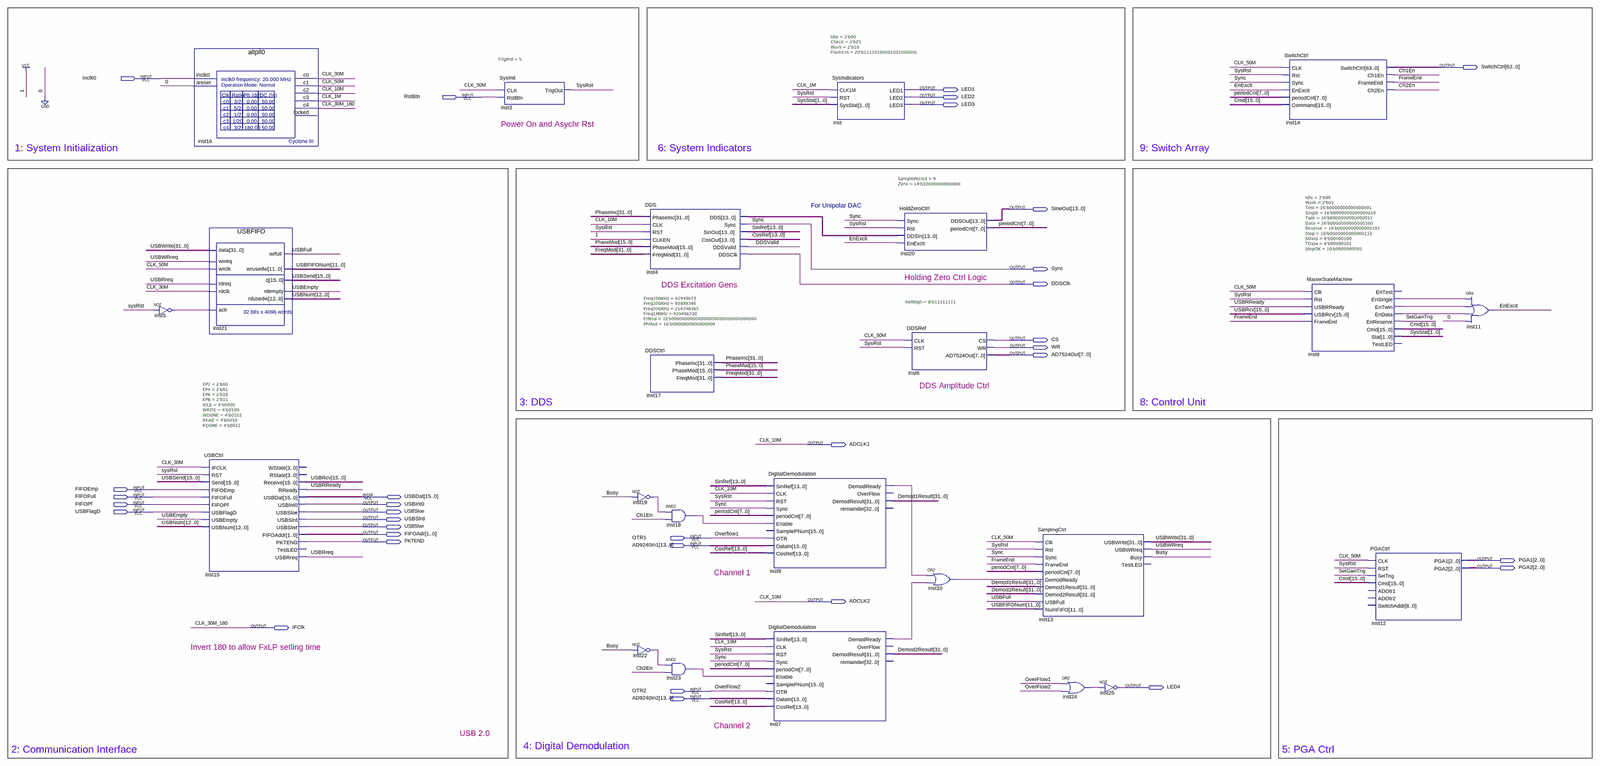
[diagram p0: schematic sheet, whole]
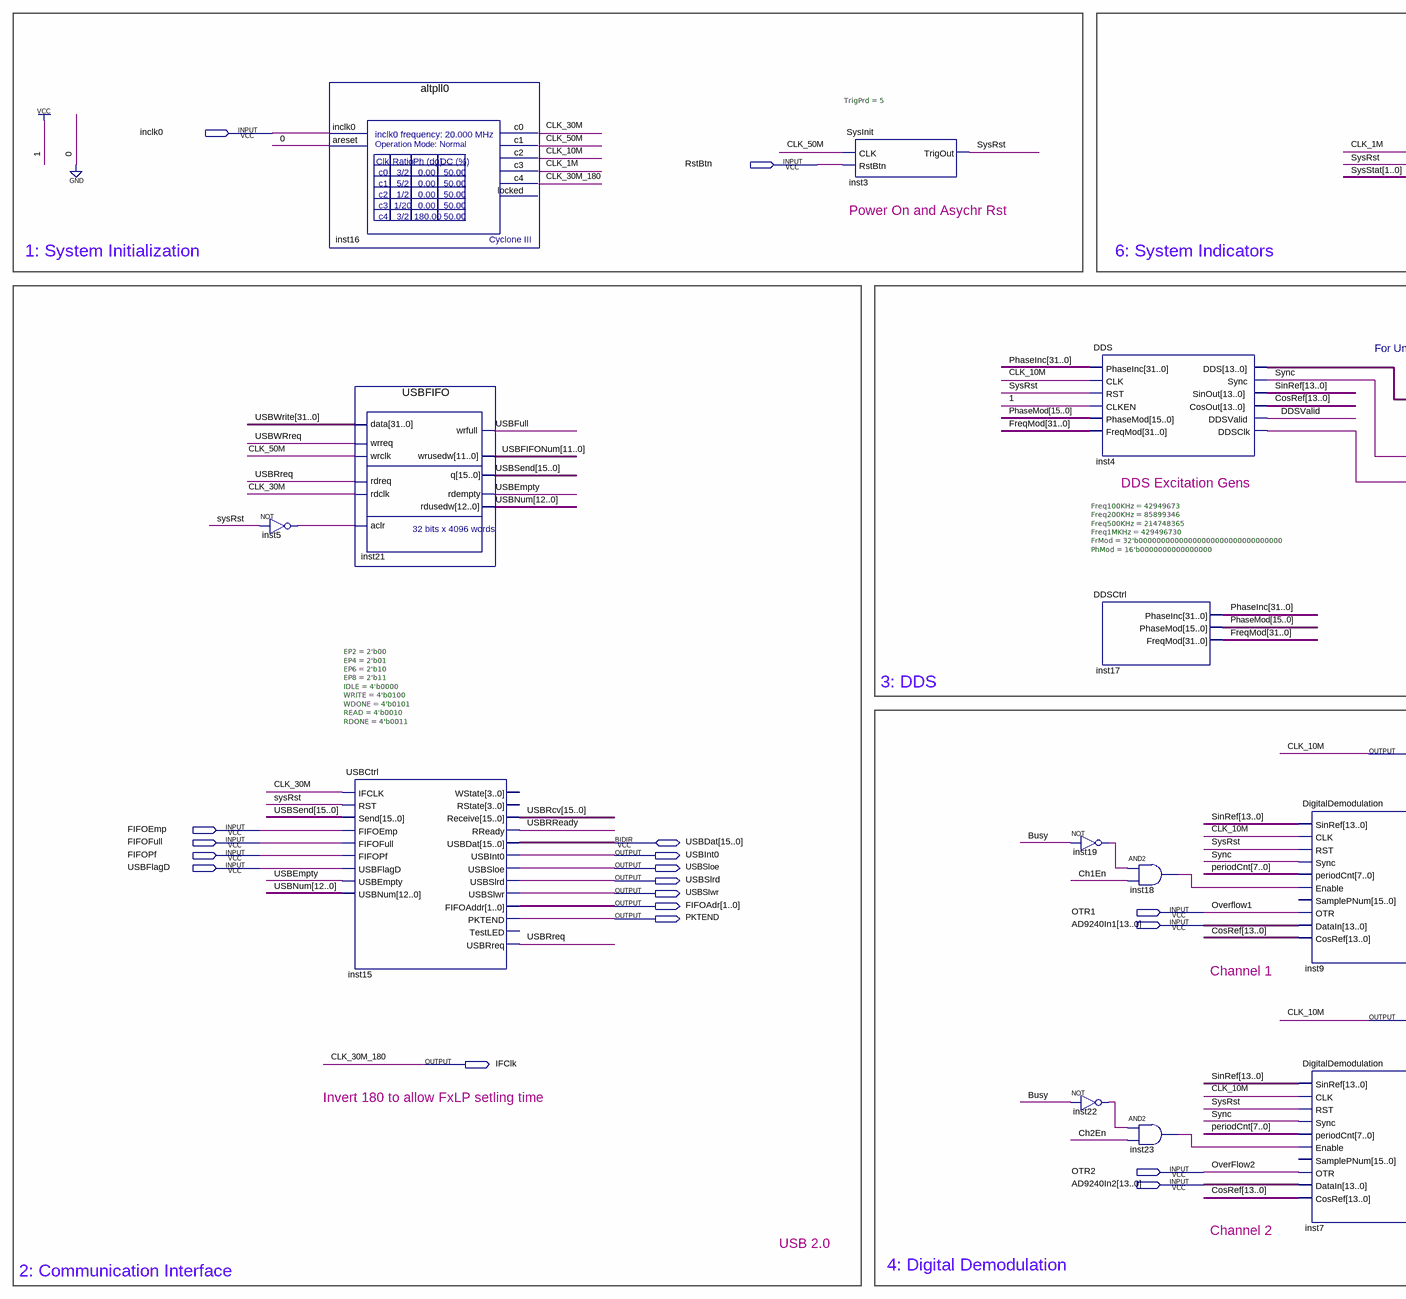
[diagram p1: schematic sheet, left part]
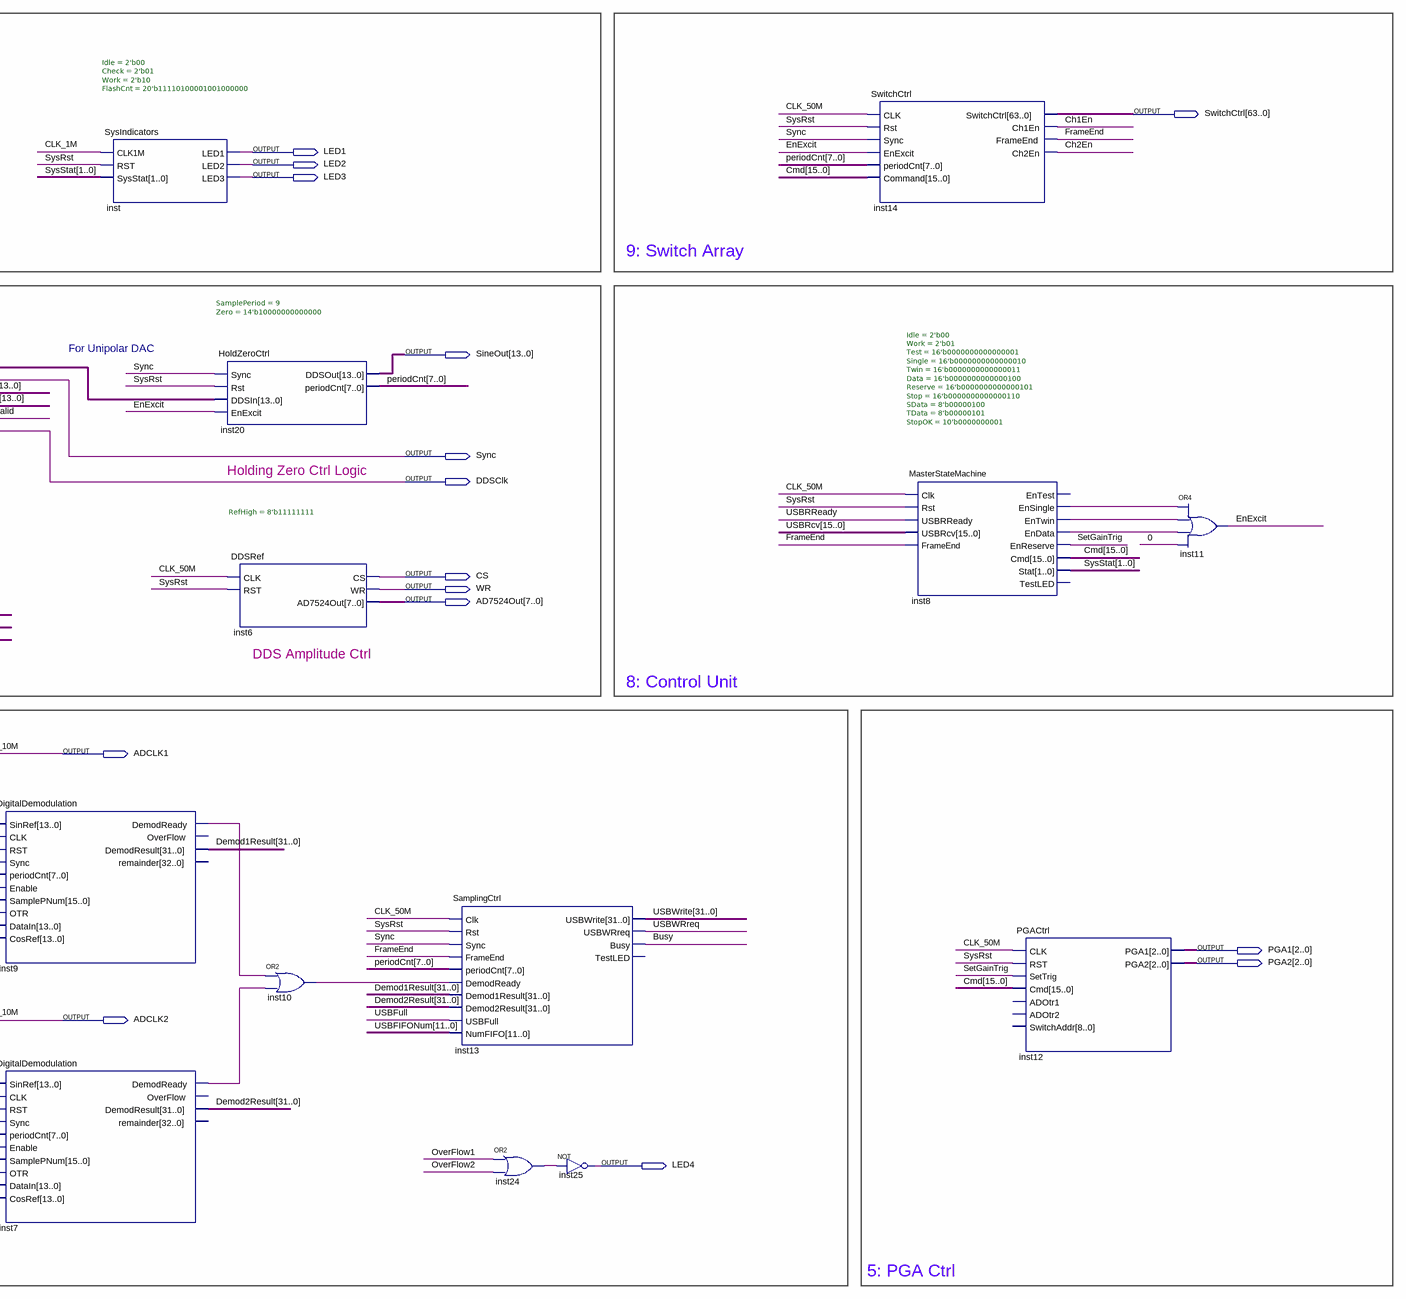
[diagram p2: schematic sheet, right part]
// Quartus schematic ECTNew.bdf as structural Verilog: 24 symbols, 33 pins
module ECTNew (
  input  inclk0,
  input  RstBtn,
  input  FIFOEmp,
  input  FIFOFull,
  input  FIFOPf,
  input  USBFlagD,
  input  OTR1,
  input  [13:0] AD9240In1,
  input  OTR2,
  input  [13:0] AD9240In2,
  inout  [15:0] USBDat,
  output [63:0] SwitchCtrl,
  output LED1,
  output LED2,
  output LED3,
  output [13:0] SineOut,
  output Sync,
  output DDSClk,
  output CS,
  output WR,
  output [7:0] AD7524Out,
  output ADCLK1,
  output USBInt0,
  output USBSloe,
  output USBSlrd,
  output USBSlwr,
  output [1:0] FIFOAdr,
  output PKTEND,
  output [2:0] PGA1,
  output [2:0] PGA2,
  output ADCLK2,
  output IFClk,
  output LED4
);

  wire Busy, Ch1En, Ch2En, CLK_1M, CLK_30M, CLK_50M, DDSValid, EnExcit, FrameEnd, inst5_out,
       inst7_demodready, inst8_endata, inst8_ensingle, inst8_entwin, inst9_demodready, inst10_out,
       inst18_out, inst19_out, inst22_out, inst23_out, inst24_out, SetGainTrig, SysRst, USBEmpty, USBFull,
       USBRReady, USBRreq, USBWRreq;
  wire [1:0] SysStat;
  wire [7:0] periodCnt;
  wire [11:0] USBFIFONum;
  wire [12:0] USBNum;
  wire [13:0] CosRef, inst4_dds, SinRef;
  wire [15:0] Cmd, PhaseMod, USBRcv, USBSend;
  wire [31:0] Demod1Result, Demod2Result, FreqMod, PhaseInc, USBWrite;

  not inst5 (inst5_out, SysRst);
  altpll0 inst16 (
    .inclk0(inclk0), .areset(1'b0), .c0(CLK_30M), .c1(CLK_50M), .c2(ADCLK1), .c3(CLK_1M), .c4(IFClk));  // open: locked
  USBFIFO inst21 (
    .data(USBWrite), .wrreq(USBWRreq), .wrclk(CLK_50M), .rdreq(USBRreq), .rdclk(CLK_30M), .aclr(inst5_out),
    .wrfull(USBFull), .wrusedw(USBFIFONum), .q(USBSend), .rdempty(USBEmpty), .rdusedw(USBNum));
  USBCtrl #(.EP2(2'b00), .EP4(2'b01), .EP6(2'b10), .EP8(2'b11), .IDLE(4'b0000), .WRITE(4'b0100), .WDONE(4'b0101), .READ(4'b0010), .RDONE(4'b0011)) inst15 (
    .IFCLK(CLK_30M), .RST(SysRst), .Send(USBSend), .FIFOEmp(FIFOEmp), .FIFOFull(FIFOFull), .FIFOPf(FIFOPf),
    .USBFlagD(USBFlagD), .USBEmpty(USBEmpty), .USBNum(USBNum), .Receive(USBRcv), .RReady(USBRReady),
    .USBInt0(USBInt0), .USBSloe(USBSloe), .USBSlrd(USBSlrd), .USBSlwr(USBSlwr), .FIFOAddr(FIFOAdr),
    .PKTEND(PKTEND), .USBRreq(USBRreq), .USBDat(USBDat));  // open: WState, RState, TestLED
  SysInit #(.TrigPrd(5)) inst3 (.CLK(CLK_50M), .RstBtn(RstBtn), .TrigOut(SysRst));
  not inst19 (inst19_out, Busy);
  not inst22 (inst22_out, Busy);
  DDS inst4 (
    .PhaseInc(PhaseInc), .CLK(ADCLK1), .RST(SysRst), .CLKEN(1'b1), .PhaseMod(PhaseMod), .FreqMod(FreqMod),
    .DDS(inst4_dds), .Sync(Sync), .SinOut(SinRef), .CosOut(CosRef), .DDSValid(DDSValid), .DDSClk(DDSClk));
  DDSCtrl #(.Freq100KHz(42949673), .Freq200KHz(85899346), .Freq500KHz(214748365), .Freq1MKHz(429496730), .FrMod(32'b00000000000000000000000000000000), .PhMod(16'b0000000000000000)) inst17 (
    .PhaseInc(PhaseInc), .PhaseMod(PhaseMod), .FreqMod(FreqMod));
  and inst18 (inst18_out, inst19_out, Ch1En);
  and inst23 (inst23_out, inst22_out, Ch2En);
  DigitalDemodulation inst9 (
    .SinRef(SinRef), .CLK(ADCLK1), .RST(SysRst), .Sync(Sync), .periodCnt(periodCnt), .Enable(inst18_out),
    .OTR(OTR1), .DataIn(AD9240In1), .CosRef(CosRef), .DemodReady(inst9_demodready), .DemodResult(Demod1Result));  // open: SamplePNum, OverFlow, remainder
  DigitalDemodulation inst7 (
    .SinRef(SinRef), .CLK(ADCLK1), .RST(SysRst), .Sync(Sync), .periodCnt(periodCnt), .Enable(inst23_out),
    .OTR(OTR2), .DataIn(AD9240In2), .CosRef(CosRef), .DemodReady(inst7_demodready), .DemodResult(Demod2Result));  // open: SamplePNum, OverFlow, remainder
  SysIndicators #(.Idle(2'b00), .Check(2'b01), .Work(2'b10), .FlashCnt(20'b11110100001001000000)) inst (
    .CLK1M(CLK_1M), .RST(SysRst), .SysStat(SysStat), .LED1(LED1), .LED2(LED2), .LED3(LED3));
  HoldZeroCtrl #(.SamplePeriod(9), .Zero(14'b10000000000000)) inst20 (
    .Sync(Sync), .Rst(SysRst), .DDSIn(inst4_dds), .EnExcit(EnExcit), .DDSOut(SineOut), .periodCnt(periodCnt));
  DDSRef #(.RefHigh(8'b11111111)) inst6 (.CLK(CLK_50M), .RST(SysRst), .CS(CS), .WR(WR), .AD7524Out(AD7524Out));
  or inst10 (inst10_out, inst9_demodready, inst7_demodready);
  SamplingCtrl inst13 (
    .Clk(CLK_50M), .Rst(SysRst), .Sync(Sync), .FrameEnd(FrameEnd), .periodCnt(periodCnt),
    .DemodReady(inst10_out), .Demod1Result(Demod1Result), .Demod2Result(Demod2Result), .USBFull(USBFull),
    .NumFIFO(USBFIFONum), .USBWrite(USBWrite), .USBWRreq(USBWRreq), .Busy(Busy));  // open: TestLED
  or inst24 (inst24_out, OTR1, OTR2);
  not inst25 (LED4, inst24_out);
  SwitchCtrl inst14 (
    .CLK(CLK_50M), .Rst(SysRst), .Sync(Sync), .EnExcit(EnExcit), .periodCnt(periodCnt), .Command(Cmd),
    .SwitchCtrl(SwitchCtrl), .Ch1En(Ch1En), .FrameEnd(FrameEnd), .Ch2En(Ch2En));
  MasterStateMachine #(.Idle(2'b00), .Work(2'b01), .Test(16'b0000000000000001), .Single(16'b0000000000000010), .Twin(16'b0000000000000011), .Data(16'b0000000000000100), .Reserve(16'b0000000000000101), .Stop(16'b0000000000000110), .SData(8'b00000100), .TData(8'b00000101), .StopOK(10'b0000000001)) inst8 (
    .Clk(CLK_50M), .Rst(SysRst), .USBRReady(USBRReady), .USBRcv(USBRcv), .FrameEnd(FrameEnd),
    .EnSingle(inst8_ensingle), .EnTwin(inst8_entwin), .EnData(inst8_endata), .EnReserve(SetGainTrig),
    .Cmd(Cmd), .Stat(SysStat));  // open: EnTest, TestLED
  PGACtrl inst12 (
    .CLK(CLK_50M), .RST(SysRst), .SetTrig(SetGainTrig), .Cmd(Cmd), .PGA1(PGA1), .PGA2(PGA2));  // open: ADOtr1, ADOtr2, SwitchAddr
  or inst11 (EnExcit, inst8_ensingle, inst8_entwin, inst8_endata, 1'b0);

  assign ADCLK2 = ADCLK1;

  // Other names for the same wires on the sheet: CLK_10M = ADCLK1; CLK_30M_180 = IFClk; OverFlow1 = OTR1;
  //   OverFlow2 = OTR2

  // Notes on the sheet:
  //   Power On and Asychr Rst 
  //   1: System Initialization
  //   6: System Indicators
  //   9: Switch Array
  //   For Unipolar DAC 
  //   Holding Zero Ctrl Logic
  //   DDS Excitation Gens
  //   DDS Amplitude Ctrl
  //   3: DDS
  //   8: Control Unit
  //   Channel 1
  //   Invert 180 to allow FxLP setling time
  //   Channel 2
  //   USB 2.0 
  //   4: Digital Demodulation
  //   2: Communication Interface
  //   5: PGA Ctrl
endmodule
